# EAGLE design shield4 (EAGLE 6.1)
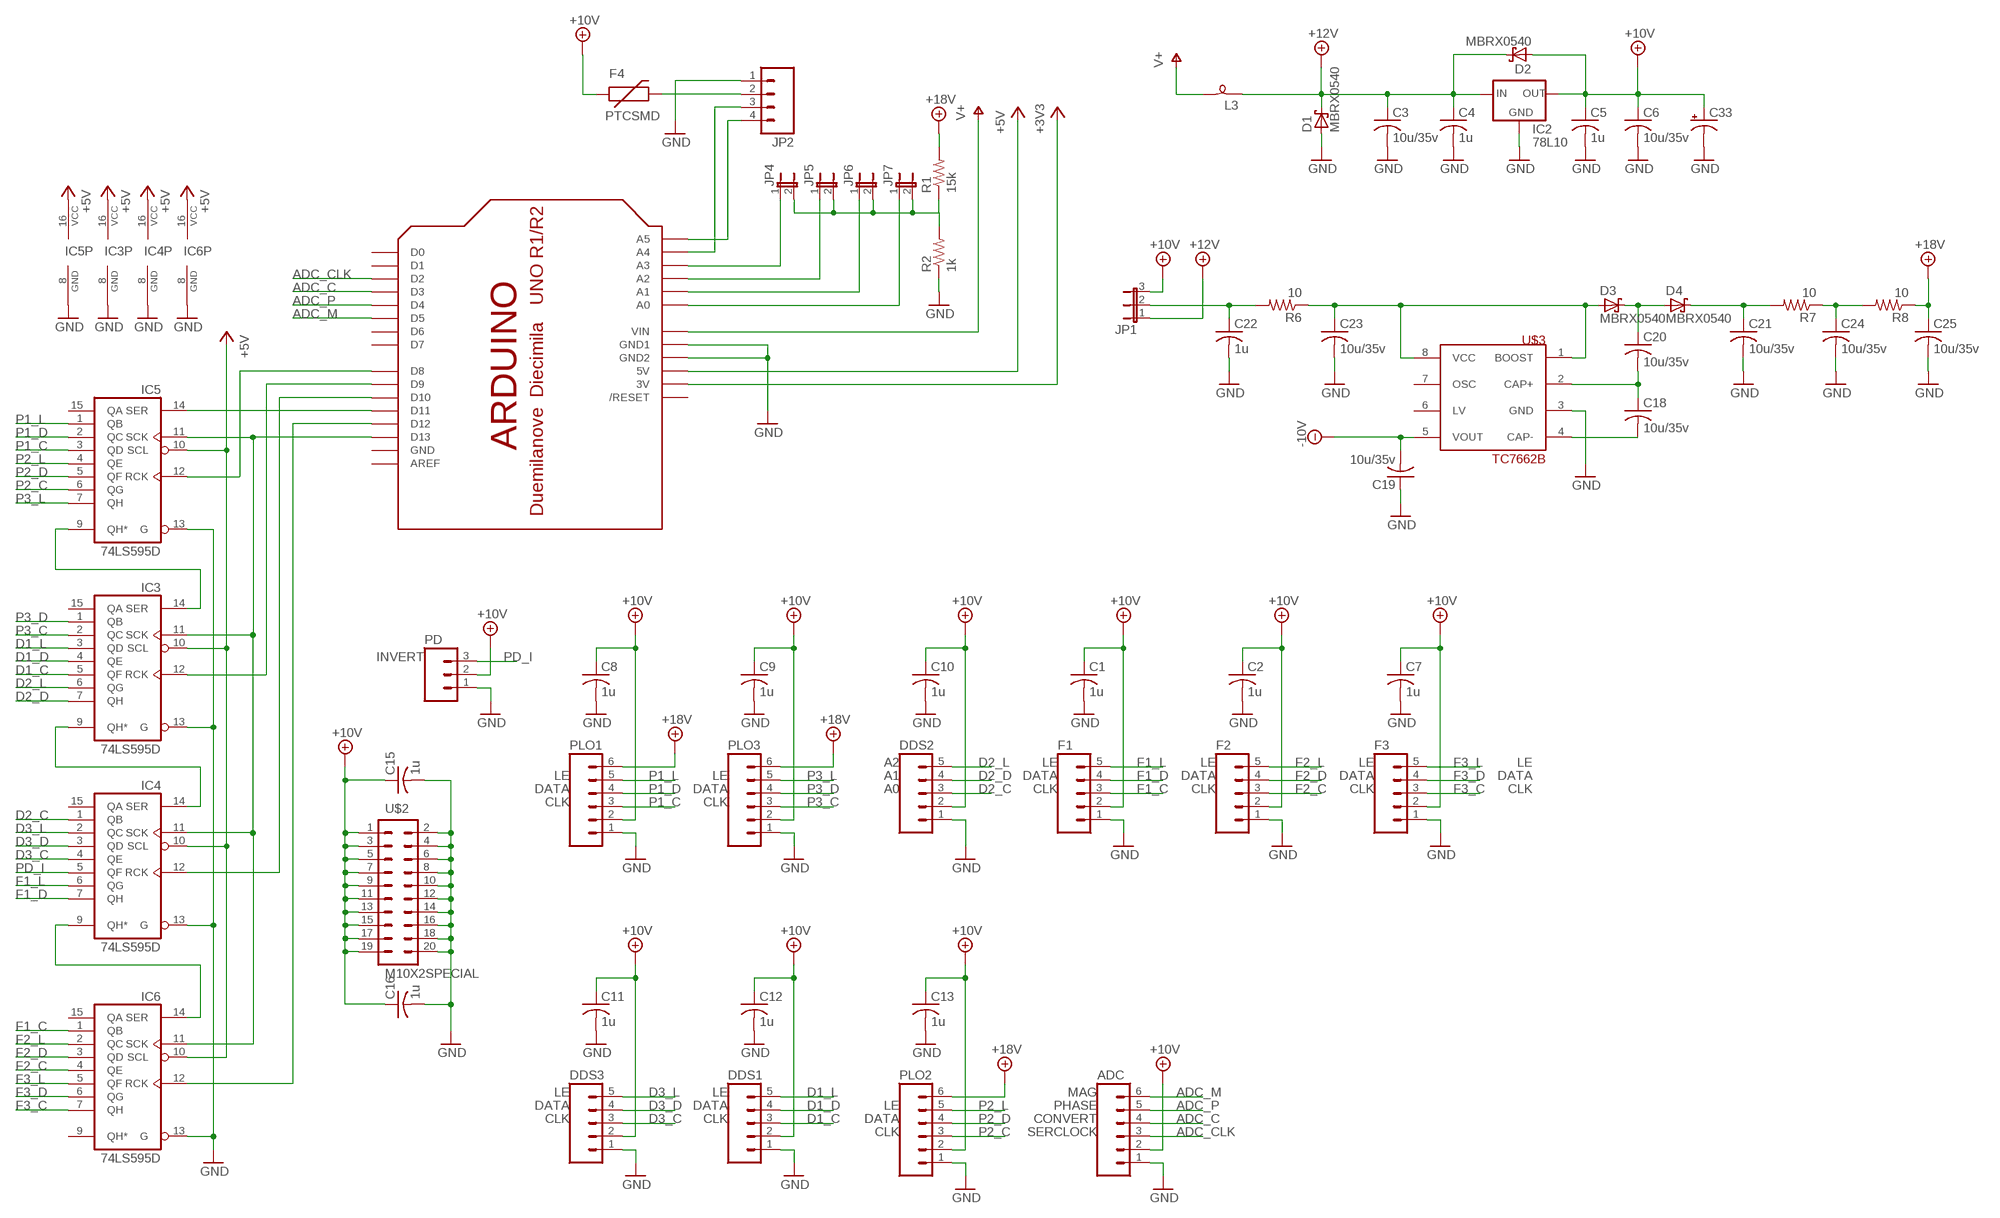
[diagram p0: schematic, sheet 1]

## Parts
ADC  M06LOCK  [1X06_LOCK]
C1  1u  C-USC0603  [C0603]
C2  1u  C-USC0603  [C0603]
C3  10u/35v  C-USC1206  [C1206]
C4  1u  C-USC0603  [C0603]
C5  1u  C-USC0603  [C0603]
C6  10u/35v  C-USC1206  [C1206]
C7  1u  C-USC0603  [C0603]
C8  1u  C-USC0603  [C0603]
C9  1u  C-USC0603  [C0603]
C10  1u  C-USC0603  [C0603]
C11  1u  C-USC0603  [C0603]
C12  1u  C-USC0603  [C0603]
C13  1u  C-USC0603  [C0603]
C15  1u  C-USC0603  [C0603]
C16  1u  C-USC0603  [C0603]
C18  10u/35v  C-USC1206  [C1206]
C19  10u/35v  C-USC1206  [C1206]
C20  10u/35v  C-USC1206  [C1206]
C21  10u/35v  C-USC1206  [C1206]
C22  1u  C-USC0603  [C0603]
C23  10u/35v  C-USC1206  [C1206]
C24  10u/35v  C-USC1206  [C1206]
C25  10u/35v  C-USC1206  [C1206]
C33  CPOL-USE2.5-6  [E2,5-6]
D1  MBRX0540  [SOD323-R]
D2  MBRX0540  [SOD323-R]
D3  MBRX0540  [SOD323-R]
D4  MBRX0540  [SOD323-R]
DDS1  M05LOCK  [1X05_LOCK]
DDS2  M05LOCK  [1X05_LOCK]
DDS3  M05LOCK  [1X05_LOCK]
F1  M05LOCK  [1X05_LOCK]
F2  M05LOCK  [1X05_LOCK]
F3  M05LOCK  [1X05_LOCK]
F4  PTCSMD  [PTC-1206]
IC2  78L10  78XXS  [78XXS]
IC3  74LS595D  [SO16]
IC4  74LS595D  [SO16]
IC5  74LS595D  [SO16]
IC6  74LS595D  [SO16]
JP1  JP2E  [JP2]
JP2  M04LOCK  [1X04_LOCK]
JP4  JUMPER-2SMD-NO  [SJ_2S-NO]
JP5  JUMPER-2SMD-NO  [SJ_2S-NO]
JP6  JUMPER-2SMD-NO  [SJ_2S-NO]
JP7  JUMPER-2SMD-NO  [SJ_2S-NO]
L3  SM-B5  [SM-B5]
PD  M03LOCK  [1X03_LOCK]
PLO1  M06LOCK  [1X06_LOCK]
PLO2  M06LOCK  [1X06_LOCK]
PLO3  M06LOCK  [1X06_LOCK]
R1  15k  R-US_R0603  [R0603]
R2  1k  R-US_R0603  [R0603]
R6  10  R-US_R0603  [R0603]
R7  10  R-US_R0603  [R0603]
R8  10  R-US_R0603  [R0603]
U$1  ARDUINO-NOHOLE  [ARDUINO-NOHOLE]
U$2  M10X2SPECIAL  [2X10_LOCK_SPECIAL]
U$3  TC7662B  [SO-08]

## Nets
+3V3: U$1.3V
+5V: IC3.10(SCL) IC3.16(VCC) IC4.10(SCL) IC4.16(VCC) IC5.10(SCL) IC5.16(VCC) IC6.10(SCL) IC6.16(VCC) U$1.5V
+10V: ADC.2 C1.1 C2.1 C5.1 C6.1 C7.1 C8.1 C9.1 C10.1 C11.1 C12.1 C13.1 C15.1 C16.1 C33.+ D2.A DDS1.2 DDS2.2 DDS3.2 F1.2 F2.2 F3.2 F4.1 IC2.OUT JP1.3 PD.2 PLO1.2 PLO2.2 PLO3.2 U$2.1 U$2.3 U$2.5 U$2.7 U$2.9 U$2.11 U$2.13 U$2.15 U$2.17 U$2.19
+12V: C3.1 C4.1 D1.C D2.C IC2.IN JP1.1 L3.1
+18V: C25.1 PLO1.6 PLO2.6 PLO3.6 R1.2 R8.1
-10V: C19.2 U$3.5(VOUT)
ADC_C: ADC.4 U$1.D3
ADC_CLK: ADC.3 U$1.D2
ADC_M: ADC.6 U$1.D5
ADC_P: ADC.5 U$1.D4
D1_C: DDS1.3 IC3.5(QF)
D1_D: DDS1.4 IC3.4(QE)
D1_L: DDS1.5 IC3.3(QD)
D2_C: DDS2.3 IC4.1(QB)
D2_D: DDS2.4 IC3.7(QH)
D2_L: DDS2.5 IC3.6(QG)
D3_C: DDS3.3 IC4.4(QE)
D3_D: DDS3.4 IC4.3(QD)
D3_L: DDS3.5 IC4.2(QC)
F1_C: F1.3 IC6.1(QB)
F1_D: F1.4 IC4.7(QH)
F1_L: F1.5 IC4.6(QG)
F2_C: F2.3 IC6.4(QE)
F2_D: F2.4 IC6.3(QD)
F2_L: F2.5 IC6.2(QC)
F3_C: F3.3 IC6.7(QH)
F3_D: F3.4 IC6.6(QG)
F3_L: F3.5 IC6.5(QF)
GND: ADC.1 C1.2 C2.2 C3.2 C4.2 C5.2 C6.2 C7.2 C8.2 C9.2 C10.2 C11.2 C12.2 C13.2 C15.2 C16.2 C19.1 C21.2 C22.2 C23.2 C24.2 C25.2 C33.- D1.A DDS1.1 DDS2.1 DDS3.1 F1.1 F2.1 F3.1 IC2.GND IC3.8(GND) IC3.13(G) IC4.8(GND) IC4.13(G) IC5.8(GND) IC5.13(G) IC6.8(GND) IC6.13(G) JP2.1 PD.1 PLO1.1 PLO2.1 PLO3.1 R2.1 U$1.GND1 U$1.GND2 U$2.2 U$2.4 U$2.6 U$2.8 U$2.10 U$2.12 U$2.14 U$2.16 U$2.18 U$2.20 U$3.3(GND)
N$1: IC5.14(SER) U$1.D11
N$2: IC3.11(SCK) IC4.11(SCK) IC5.11(SCK) IC6.11(SCK) U$1.D13
N$3: IC5.12(RCK) U$1.D8
N$4: IC3.14(SER) IC5.9(QH*)
N$5: IC3.9(QH*) IC4.14(SER)
N$6: IC4.9(QH*) IC6.14(SER)
N$7: JP2.3 U$1.A4
N$8: JP2.4 U$1.A5
N$9: F4.2 JP2.2
N$10: JP4.1 U$1.A3
N$11: JP5.1 U$1.A2
N$12: JP6.1 U$1.A1
N$13: JP7.1 U$1.A0
N$14: JP4.2 JP5.2 JP6.2 JP7.2 R1.1 R2.2
N$15: IC6.12(RCK) U$1.D12
N$16: IC4.12(RCK) U$1.D10
N$17: IC3.12(RCK) U$1.D9
N$18: C22.1 JP1.2 R6.2
N$19: C23.1 D3.A R6.1 U$3.1(BOOST) U$3.8(VCC)
N$20: C18.2 U$3.4(CAP-)
N$21: C18.1 C20.2 U$3.2(CAP+)
N$22: C20.1 D3.C D4.A
N$23: C21.1 D4.C R7.2
N$24: C24.1 R7.1 R8.2
P1_C: IC5.3(QD) PLO1.3
P1_D: IC5.2(QC) PLO1.4
P1_L: IC5.1(QB) PLO1.5
P2_C: IC5.6(QG) PLO2.3
P2_D: IC5.5(QF) PLO2.4
P2_L: IC5.4(QE) PLO2.5
P3_C: IC3.2(QC) PLO3.3
P3_D: IC3.1(QB) PLO3.4
P3_L: IC5.7(QH) PLO3.5
PD_I: IC4.5(QF) PD.3
V+: L3.2 U$1.VIN
Unconnected: IC3.15(QA) IC4.15(QA) IC5.15(QA) IC6.9(QH*) IC6.15(QA) U$1.AREF U$1.D0 U$1.D1 U$1.D6 U$1.D7 U$1.RESET(/RESET) U$3.6(LV) U$3.7(OSC)

## Notes on the sheet
- INVERT
- A2 | LE | LE | LE | LE
- LE | LE | A1 | DATA | DATA | DATA | DATA
- DATA | DATA | A0 | CLK | CLK | CLK | CLK
- CLK | CLK
- LE | LE | MAG
- DATA | DATA | LE | PHASE
- CLK | CLK | DATA | CONVERT
- CLK | SERCLOCK

## Power pins joined to a net without a drawn wire
GND: U$1.GND

## Library data of the parts
ADC PLO1-PLO3 = SparkFun:M06: Header 6 Standard 6-pin 0.1" header. Use with straight break away headers (SKU : PRT-00116), right angle break away headers (PRT-00553), swiss pins (PRT-00743), machine pins (PRT-00117), and female headers (PRT-00115). Molex polarized connector foot print use with SKU : PRT-08094 with associated crimp pins and housings. NOTES ON THE VARIANTS LOCK and LOCK_LONGPADS... This footprint was designed to help hold the alignment of a through-hole component (i.e. 6-pin header) while soldering it into place. You may notice that each hole has been shifted either up or down by 0.005 of an inch from it's more standard position (which is a perfectly straight line). This slight alteration caused the pins (the squares in the middle) to touch the edges of the holes. Because they are alternating, it causes a "brace" to hold the component in place. 0.005 has proven to be the perfect amount of "off-center" position when using our standard breakaway headers. Although looks a little odd when you look at the bare footprint, once you have a header in there, the alteration is very hard to notice. Also, if you push a header all the way into place, it is covered up entirely on the bottom side. This idea of altering the position of holes to aid alignment will be further integrated into the Sparkfun Library for other footprints. It can help hold any component with 3 or more connection pins.
C1-C13 C15 C16 C18-C25 = rcl:C-US: CAPACITOR, American symbol
C33 = rcl:CPOL-US: POLARIZED CAPACITOR, American symbol
D1-D4 = Misc:MBRX0540
DDS1-DDS3 F1-F3 = SparkFun:M05: Header 5 Standard 5-pin 0.1" header. Use with straight break away headers (SKU : PRT-00116), right angle break away headers (PRT-00553), swiss pins (PRT-00743), machine pins (PRT-00117), and female headers (PRT-00115). Molex polarized connector foot print use with SKU : PRT-08230 with associated crimp pins and housings.
F4 = SparkFun:PTC: Resettable Fuse PTC Resettable Fuse. Spark Fun Electronics SKU : COM-08357
IC2 = v-reg:78XXS: VOLTAGE REGULATOR
IC3-IC6 = 74xx-us:74*595: 8-bit SHIFT REGISTER, output latch
JP1 = jumper:JP2E: JUMPER
JP2 = SparkFun:M04: Header 4 Standard 4-pin 0.1" header. Use with straight break away headers (SKU : PRT-00116), right angle break away headers (PRT-00553), swiss pins (PRT-00743), machine pins (PRT-00117), and female headers (PRT-00115). Molex polarized connector foot print use with SKU : PRT-08231 with associated crimp pins and housings. 1MM SMD Version SKU: PRT-10208
JP4-JP7 = SparkFun:JUMPER-2: Jumper Basic 0.1" spaced jumper. Use with breakaway headers.
L3 = inductor-neosid:SM-B: INDUCTOR SMD Bead inductor; OC_FARNELL: unknown; OC_NEWARK: unknown
PD = SparkFun:M03: Header 3 Standard 3-pin 0.1" header. Use with straight break away headers (SKU : PRT-00116), right angle break away headers (PRT-00553), swiss pins (PRT-00743), machine pins (PRT-00117), and female headers (PRT-00115). Molex polarized connector foot print use with SKU : PRT-08232 with associated crimp pins and housings.
R1 R2 R6-R8 = rcl:R-US_: RESISTOR, American symbol
U$1 = adafruit:ARDUINO: Arduino Diecimila/Duemilanove Make a shield with ease, this package has all the named pins as well as the two mounting drill holes and an outline of the USB and DC power connector. The outline is on the DIMENSION layer, so if your board house uses it they will cut the outline to match. http://www.ladyada.net/library/pcb/eaglelibrary.html
U$2 = SparkFun:M10X2: This was SPECIALLY designed to be used with our Graphic LCD Backpack. Be sure you want to use this! It is not only staggered on each line of header holes, but IT IS ALSO offset of the center point of the top and bottom lines by 5 mil. This causes the headers to lock into place on the "standard" footprint on the LCD screen. The extra squares on the tdocu layer are there simply to reference other pins (if you were to actually populate a longer header than ten long - this is what we do with the backpacks).
U$3 = microchip:TC7662B

## Board
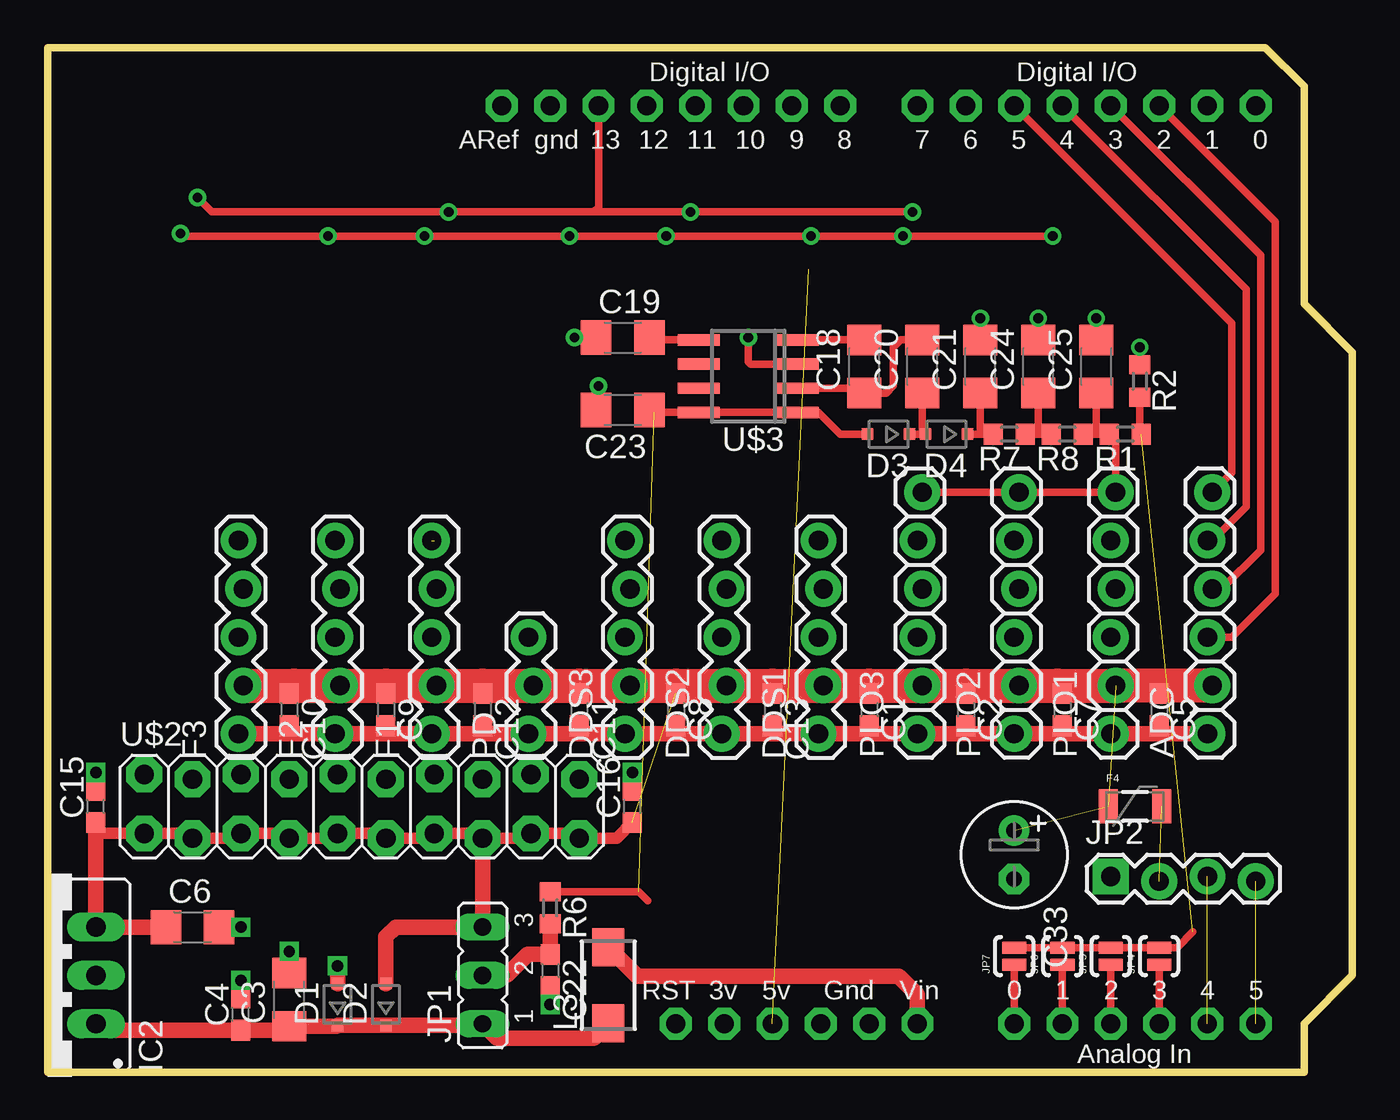
[diagram p1: board, top side]
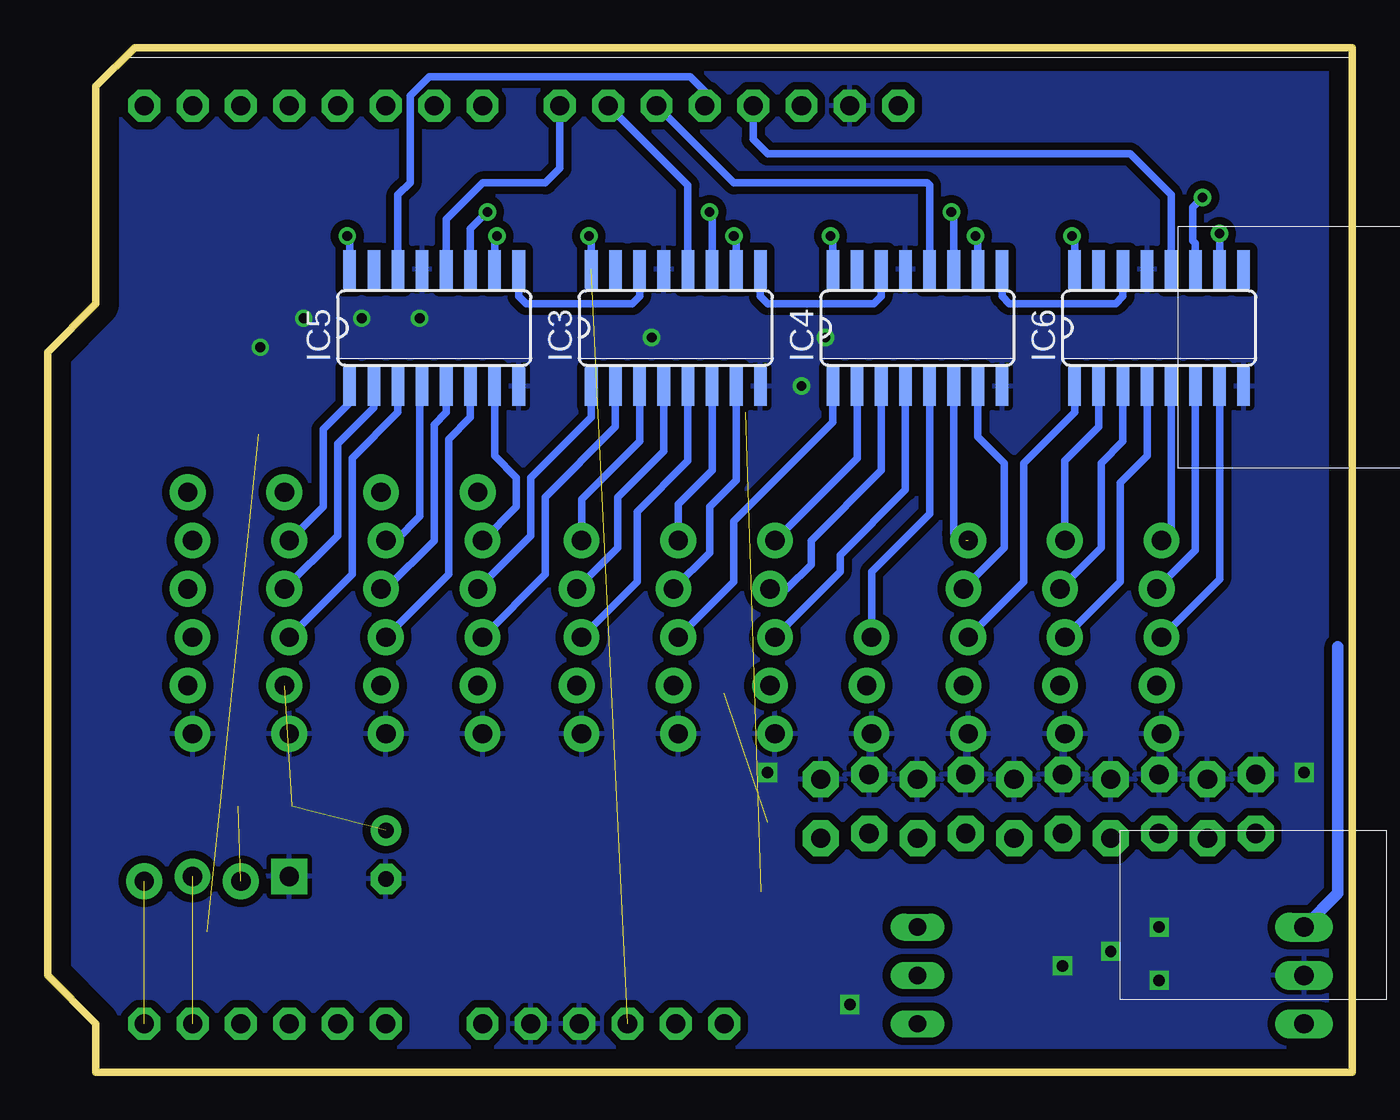
[diagram p2: board, bottom side, seen from below]

Size 68.58 x 53.85 mm. Coordinates in mm from the lower left corner, seen from the top.
Outline: 0,53.85 64.01,53.85 66.04,51.82 66.04,40.39 68.58,37.85 68.58,5.08 66.04,2.54 66.04,0 0,0 0,53.85
Copper layers (1*16): Top 0.035mm / dielectric 1.5mm / Bottom 0.035mm
Design rules: minimum track width 10mil, minimum drill 20mil, track to track 8mil, track to pad 8mil, pad to pad 8mil, via to via 8mil, smd to smd 8mil, copper to edge 40mil, drill to drill 8mil, minimum pad ring 10mil, minimum via ring 8mil, stop-mask expansion 4mil, vias tented up to drill 0mil, thermal gap 10mil

### Footprints (pad centres in the part's own frame; a part is rotated, then mirrored left to right if it is on the bottom)
1X06_LOCK = drill 1.016 pad 1.88: 1 0,0; 2 2.54,-0.254; 3 5.08,0; 4 7.62,-0.254; 5 10.16,0; 6 12.7,-0.254
C0603 = smd 1.1 x 1: 1 -0.85,0; 2 0.85,0
C1206 = smd 1.6 x 1.8: 1 -1.4,0; 2 1.4,0
E2,5-6 = drill 0.813 pad 1.6: + -1.27,0 | drill 0.813 pad 1.6 octagon: - 1.27,0
SOD323-R = smd 0.6 x 0.6: A 1.1,0; C -1.1,0
1X05_LOCK = drill 1.016 pad 1.88: 1 0,0.127; 2 2.54,-0.127; 3 5.08,0.127; 4 7.62,-0.127; 5 10.16,0.127
PTC-1206 = smd 1 x 1.8: 1 -1.4,0; 2 1.4,0
78XXS = drill 1.016 long: GND 0,-2.54; IN -2.54,-2.54; OUT 2.54,-2.54
SO16 = smd 0.66 x 2.032: 1 -4.445,-3.073; 2 -3.175,-3.073; 3 -1.905,-3.073; 4 -0.635,-3.073; 5 0.635,-3.073; 6 1.905,-3.073; 7 3.175,-3.073; 8 4.445,-3.073; 9 4.445,3.073; 10 3.175,3.073; 11 1.905,3.073; 12 0.635,3.073; 13 -0.635,3.073; 14 -1.905,3.073; 15 -3.175,3.073; 16 -4.445,3.073
JP2 = drill 0.914 long: 1 -2.54,0; 2 0,0; 3 2.54,0
1X04_LOCK = drill 1.016 pad 1.88 square: 1 0,0.127 | drill 1.016 pad 1.88: 2 2.54,-0.127; 3 5.08,0.127; 4 7.62,-0.127
SJ_2S-NO = smd 0.635 x 1.27: 1 -0.45,0; 2 0.45,0
SM-B5 = smd 2 x 1.7: 1 -2,0; 2 2,0
1X03_LOCK = drill 1.016 pad 1.88: 1 0,0.127; 2 2.54,-0.127; 3 5.08,0.127
R0603 = smd 1 x 1.1: 1 -0.85,0; 2 0.85,0
ARDUINO-NOHOLE = drill 1 pad 1.676 octagon: 3V 35.56,2.54; 5V 38.1,2.54; A0 50.8,2.54; A1 53.34,2.54; A2 55.88,2.54; A3 58.42,2.54; A4 60.96,2.54; A5 63.5,2.54; AREF 23.876,50.8; D0 63.5,50.8; D1 60.96,50.8; D2 58.42,50.8; D3 55.88,50.8; D4 53.34,50.8; D5 50.8,50.8; D6 48.26,50.8; D7 45.72,50.8; D8 41.656,50.8; D9 39.116,50.8; D10 36.576,50.8; D11 34.036,50.8; D12 31.496,50.8; D13 28.956,50.8; GND 26.416,50.8; GND1 43.18,2.54; GND2 40.64,2.54; RESET 33.02,2.54; VIN 45.72,2.54
2X10_LOCK_SPECIAL = drill 1.016 pad 1.88 octagon: 1 -11.43,-1.422; 2 -11.43,1.676; 3 -8.89,-1.676; 4 -8.89,1.422; 5 -6.35,-1.422; 6 -6.35,1.676; 7 -3.81,-1.676; 8 -3.81,1.422; 9 -1.27,-1.422; 10 -1.27,1.676; 11 1.27,-1.676; 12 1.27,1.422; 13 3.81,-1.422; 14 3.81,1.676; 15 6.35,-1.676; 16 6.35,1.422; 17 8.89,-1.422; 18 8.89,1.676; 19 11.43,-1.676; 20 11.43,1.422
SO-08 = smd 0.6 x 2.2: 1 -1.905,-2.6; 2 -0.635,-2.6; 3 0.635,-2.6; 4 1.905,-2.6; 5 1.905,2.6; 6 0.635,2.6; 7 -0.635,2.6; 8 -1.905,2.6

### Placement (x,y rotation side)
ADC  60.96,17.78 90 top
C1  43.18,19.05 270 top
C2  48.26,19.05 270 top
C3  12.7,3.81 90 top
C4  10.16,3.05 90 top
C5  58.42,19.05 270 top
C6  7.62,7.62 0 top
C7  53.34,19.05 270 top
C8  33.02,19.05 270 top
C9  17.78,19.05 270 top
C10  12.7,19.05 270 top
C11  27.94,19.05 270 top
C12  22.86,19.05 270 top
C13  38.1,19.05 270 top
C15  2.54,13.97 90 top
C16  30.73,13.97 90 top
C18  42.93,37.08 90 top
C19  30.23,38.61 0 top
C20  45.97,37.08 90 top
C21  49.02,37.08 90 top
C22  26.42,5.33 270 top
C23  30.23,34.8 180 top
C24  52.07,37.08 90 top
C25  55.12,37.08 90 top
C33  50.8,11.43 270 top
D1  15.24,3.56 90 top
D2  17.78,3.56 90 top
D3  44.2,33.53 180 top
D4  47.24,33.53 180 top
DDS1  40.64,17.78 90 top
DDS2  35.56,17.78 90 top
DDS3  30.48,17.78 90 top
F1  20.32,17.78 90 top
F2  15.24,17.78 90 top
F3  10.16,17.78 90 top
F4  57.15,13.97 0 top
IC2  0,5.08 90 top
IC3  35.56,39.12 0 bottom
IC4  22.86,39.12 0 bottom
IC5  48.26,39.12 0 bottom
IC6  10.16,39.12 0 bottom
JP1  22.86,5.08 90 top
JP2  55.88,10.16 0 top
JP4  58.42,6.1 90 top
JP5  55.88,6.1 90 top
JP6  53.34,6.1 90 top
JP7  50.8,6.1 90 top
L3  29.46,4.57 90 top
PD  25.4,17.78 90 top
PLO1  55.88,17.78 90 top
PLO2  50.8,17.78 90 top
PLO3  45.72,17.78 90 top
R1  56.64,33.53 180 top
R2  57.4,36.32 270 top
R6  26.42,8.64 270 top
R7  50.55,33.53 180 top
R8  53.59,33.53 180 top
U$1  0,0 0 top
U$2  16.51,13.97 0 top
U$3  36.83,36.58 90 top

### Tracks (layer width: path | path; a pad name or v marks a point on that pad's centre or on a via)
+5V  (via drill 0.51)  (1 unrouted)
  Top 0.406: v6.99,44.07 7.11,43.94 v14.73,43.94 v19.81,43.94 v27.43,43.94 v32.51,43.94 v40.13,43.94 v44.96,43.94 v52.83,43.94
  Bottom 0.406: IC6.10 v6.99,44.07 | IC4.10 19.68,43.81 v19.81,43.94 | IC6.16 14.61,43.81 v14.73,43.94 | IC4.16 27.3,43.81 v27.43,43.94 | IC3.10 32.38,43.81 v32.51,43.94 | IC3.16 40.01,43.81 v40.13,43.94 | IC5.10 45.09,43.81 v44.96,43.94 | IC5.16 52.7,43.81 v52.83,43.94
+10V  (3 unrouted)
  Top 0.61: C16.1 29.91,12.29 U$2.19 27.69,12.55 U$2.17 25.15,12.29 U$2.15 22.61,12.55 U$2.13 20.07,12.29 U$2.11 17.53,12.55 U$2.9 14.99,12.29 U$2.7 12.45,12.55 U$2.5 9.91,12.29 U$2.3 7.37,12.55 U$2.1 2.69,12.55 2.54,12.7 | 2.54,12.61 C15.1
  Top 0.813: 2.54,12.7 2.54,12.61 IC2.OUT C6.1 | D2.A 17.78,7.11 18.29,7.62 JP1.3 U$2.15 | C10.1 12.7,20.07 12.95,20.32 | C9.1 17.78,20.32 | C12.1 22.86,20.32 | C11.1 27.94,20.32 | C8.1 33.02,20.32 | C13.1 38.1,20.32 | C1.1 43.18,20.32 | C2.1 48.26,20.32 | C7.1 53.34,20.07 53.09,20.32 | C5.1 58.42,20.32
  Top 1.778: ADC.2 58.42,20.32 PLO1.2 53.09,20.32 PLO2.2 48.26,20.32 PLO3.2 43.18,20.32 DDS1.2 38.1,20.32 DDS2.2 33.02,20.32 DDS3.2 27.94,20.32 PD.2 22.86,20.32 F1.2 17.78,20.32 F2.2 12.95,20.32 F3.2
  Bottom 0.61: 0.76,22.35 0.76,9.4 IC2.OUT
+12V
  Top 0.813: IC2.IN 2.88,2.2 C4.1 12.49,2.2 C3.1 15.19,2.41 D1.C D2.C 22.78,2.46 JP1.1 23.62,1.78 28.7,1.78 29.46,2.54 L3.1
+18V
  Top 0.406: PLO3.6 PLO2.6 PLO1.6 56.13,33.27 55.88,33.53 R1.2 55.12,33.53 | R8.1 55.12,33.53 | C25.1 55.12,33.53
-10V
  Top 0.406: U$3.5 31.75,38.48 C19.2
ADC_C
  Top 0.406: ADC.4 61.72,25.4 63.75,27.43 63.75,42.93 U$1.D3
ADC_CLK
  Top 0.406: U$1.D2 64.52,44.7 64.52,25.15 62.23,22.86 ADC.3
ADC_M
  Top 0.406: ADC.6 62.23,31.5 62.23,39.37 U$1.D5
ADC_P
  Top 0.406: ADC.5 61.21,27.94 62.99,29.72 62.99,41.15 U$1.D4
D1_C
  Bottom 0.406: IC3.5 34.92,32.13 37.59,29.46 37.59,25.78 DDS1.3
D1_D
  Bottom 0.406: IC3.4 36.2,32.64 38.61,30.23 38.61,27.56 DDS1.4
D1_L
  Bottom 0.406: IC3.3 37.47,33.15 40.51,30.1 DDS1.5
D2_C
  Bottom 0.406: IC4.1 27.3,34.16 32.51,28.96 32.51,25.78 DDS2.3
D2_D
  Bottom 0.406: IC3.7 32.38,31.11 33.78,29.72 33.78,27.3 DDS2.4
D2_L
  Bottom 0.406: IC3.6 33.66,31.62 35.43,29.84 DDS2.5
D3_C
  Bottom 0.406: IC4.4 23.5,30.61 26.92,27.18 26.92,26.29 DDS3.3
D3_D
  Bottom 0.406: IC4.3 24.77,31.62 28.45,27.94 28.45,26.67 29.72,25.4 DDS3.4
D3_L
  Bottom 0.406: IC4.2 26.04,32.26 DDS3.5
F1_C
  Bottom 0.406: IC6.1 14.61,34.67 17.27,32 17.27,25.78 F1.3
F1_D
  Bottom 0.406: IC4.7 19.68,33.4 18.29,32 18.29,27.56 F1.4
F1_L  (1 unrouted)
  Bottom 0.406: IC4.6 20.95,28.32 20.57,27.94 20.32,27.94
F2_C
  Bottom 0.406: IC6.4 10.79,32.38 12.19,30.99 12.19,25.78 F2.3
F2_D
  Bottom 0.406: IC6.3 12.06,33.15 13.21,32 13.21,27.56 F2.4
F2_L
  Bottom 0.406: IC6.2 13.34,33.91 15.11,32.13 F2.5
F3_C
  Bottom 0.406: IC6.7 6.99,25.91 F3.3
F3_D
  Bottom 0.406: IC6.6 8.26,27.43 F3.4
F3_L
  Bottom 0.406: IC6.5 9.53,28.45 F3.5
GND  (via drill 0.51, 0.6)
  Top 0.406: C15.2 v2.54,15.75 | U$3.3 36.96,37.21 36.83,37.34 v36.83,38.61 | C23.2 v28.96,36.07 | C19.1 v27.69,38.61 | C21.2 v49.02,39.62 | C24.2 v52.07,39.62 | C25.2 v55.12,39.62 | R2.1 v57.4,38.1
  Top 0.61: C6.2 v10.16,7.62 | C4.2 v10.16,4.83 | C3.2 v12.7,6.35 | C16.2 v30.73,15.75
  Top 0.813: D1.A v15.24,5.59 | C22.2 v26.42,3.56 | 58.42,17.78 PLO1.1 53.34,17.78 | 58.42,17.78 ADC.1 | C5.2 58.42,17.78 | 53.34,17.78 PLO2.1 48.26,17.78 | C7.2 53.34,17.78 | 48.26,17.78 PLO3.1 43.18,17.78 | C2.2 48.26,17.78 | 38.1,17.78 DDS2.1 33.02,17.78 | 38.1,17.78 43.18,17.78 | C13.2 38.1,17.78 | C1.2 43.18,17.78 | 27.94,17.78 PD.1 23.11,17.78 | 27.94,17.78 33.02,17.78 | C11.2 27.94,17.78 | C8.2 33.02,17.78 | 17.78,17.78 F2.1 12.7,17.78 | 17.78,17.78 23.11,17.78 | C9.2 17.78,17.78 | C12.2 22.86,18.03 23.11,17.78 | 12.7,17.78 10.16,17.78 | C10.2 12.7,17.78
  pour Bottom (isolate 0.406): 0,53.34 0,0 66.04,0 66.04,2.54 68.58,5.08 68.58,37.85 66.04,40.39 66.04,51.82 64.52,53.34
N$1
  Bottom 0.406: U$1.D11 34.04,51.56 34.8,52.32 48.51,52.32 49.53,51.31 49.53,46.74 50.16,46.1 IC5.14
N$2  (via drill 0.51)
  Top 0.406: 28.7,45.21 v33.78,45.21 v45.47,45.21 | 28.7,45.21 v21.08,45.21 8.64,45.21 v7.87,45.97 | U$1.D13 28.96,45.47 28.7,45.21
  Bottom 0.406: v45.47,45.21 46.35,44.32 IC5.11 | IC3.11 33.66,45.09 v33.78,45.21 | IC4.11 20.95,45.09 v21.08,45.21 | IC6.11 8.26,43.56 8.38,43.69 8.38,45.47 v7.87,45.97
N$3
  Bottom 0.406: U$1.D8 41.66,47.5 42.42,46.74 45.72,46.74 47.62,44.83 IC5.12
N$4
  Bottom 0.406: IC3.14 37.47,40.77 37.85,40.39 43.43,40.39 43.81,40.77 IC5.9
N$5
  Bottom 0.406: IC4.14 24.77,40.77 25.15,40.39 30.73,40.39 31.11,40.77 IC3.9
N$6
  Bottom 0.406: IC6.14 12.06,40.77 12.45,40.39 18.03,40.39 18.41,40.77 IC4.9
N$7  (1 unrouted)
N$8  (1 unrouted)
N$9  (1 unrouted)
N$10
  Top 0.406: U$1.A3 JP4.1
N$11
  Top 0.406: U$1.A2 JP5.1
N$12
  Top 0.406: U$1.A1 JP6.1
N$13
  Top 0.406: U$1.A0 JP7.1
N$14  (1 unrouted)
  Top 0.406: JP7.2 JP6.2 JP5.2 JP4.2 59.38,6.55 60.2,7.37 | R2.2 57.4,33.62 R1.1
N$15
  Bottom 0.406: U$1.D12 31.5,49.02 30.73,48.26 11.68,48.26 9.53,46.1 IC6.12
N$16
  Bottom 0.406: IC4.12 22.23,46.61 22.35,46.74 32.51,46.74 U$1.D10
N$17
  Bottom 0.406: IC3.12 34.92,46.61 U$1.D9
N$18
  Top 0.813: JP1.2 24.13,5.08 25.23,6.18 C22.1 R6.2
N$19  (1 unrouted)
  Top 0.406: R6.1 31.08,9.49 31.55,9.02 | D3.A 41.66,33.53 40.51,34.67 U$3.1 U$3.8 31.88,34.67 31.75,34.8 C23.1
N$20
  Top 0.406: U$3.4 C18.2
N$21
  Top 0.406: U$3.2 42.67,35.94 C18.1 44.07,35.68 44.45,36.07 44.45,38.1 44.83,38.48 C20.2
N$22
  Top 0.406: D3.C D4.A 45.97,33.7 C20.1
N$23
  Top 0.406: D4.C 49.02,33.53 | 49.02,33.53 R7.2 | C21.1 49.02,33.53
N$24
  Top 0.406: R7.1 52.07,33.53 | 52.07,33.53 R8.2 | C24.1 52.07,33.53
P1_C
  Bottom 0.406: IC5.3 50.16,34.67 52.58,32.26 52.58,26.16 PLO1.3
P1_D
  Bottom 0.406: IC5.2 51.44,34.92 53.34,33.02 53.34,28.19 PLO1.4
P1_L
  Bottom 0.406: PLO1.5 54.1,29.72 54.1,33.78 52.7,35.18 IC5.1
P2_C
  Bottom 0.406: IC5.6 46.35,34.42 47.5,33.27 47.5,26.16 PLO2.3
P2_D
  Bottom 0.406: IC5.5 47.62,34.67 48.26,34.04 48.26,27.94 50.8,25.4 PLO2.4
P2_L
  Bottom 0.406: IC5.4 48.9,35.94 49.02,35.81 49.02,29.21 50.29,27.94 PLO2.5
P3_C
  Bottom 0.406: IC3.2 38.73,33.91 42.42,30.23 42.42,26.16 PLO3.3
P3_D
  Bottom 0.406: PLO3.4 43.18,28.19 43.18,31.24 40.01,34.42 IC3.1
P3_L
  Bottom 0.406: IC5.7 45.09,32.38 43.94,31.24 43.94,29.72 PLO3.5
PD_I
  Bottom 0.406: IC4.5 22.23,29.34 25.27,26.29 PD.3
V+
  Top 0.813: U$1.VIN 45.72,4.06 44.74,5.05 30.99,5.05 L3.2

### Text on the board
_tsilk: Digital I/O | Digital I/O | ARef | gnd | 13 | 12 | 11 | 10 | 9 | 8 | 7 | 6 | 5 | 4 | 3 | 2 | 1 | 0 | 74LS595D | 74LS595D | 74LS595D | 74LS595D | 74LS595D | PLO1 | PLO2 | PLO3 | ADC | DDS1 | DDS2 | DDS3 | F1 | F2 | F3 | F4 | PD | 10u/35v | 10u/35v | 10 | 10 | 10u/35v | 10u/35v | D4 | 10u/35v | 1u | 1u | 1u | D3 | 10u/35v | 10u/35v | 10 | 10u/35v | L3 | 10u/35v | D2 | 1u | D1 | 78L10 | TC7662B | RST | 3v | 5v | Gnd | Vin | 0 | 1 | 2 | 3 | 4 | 5 | C33 | Analog In
_bsilk: 1k | R2 | R1 | 15k | JP7 | JP6 | JP5 | JP4 | JP3 | JP2